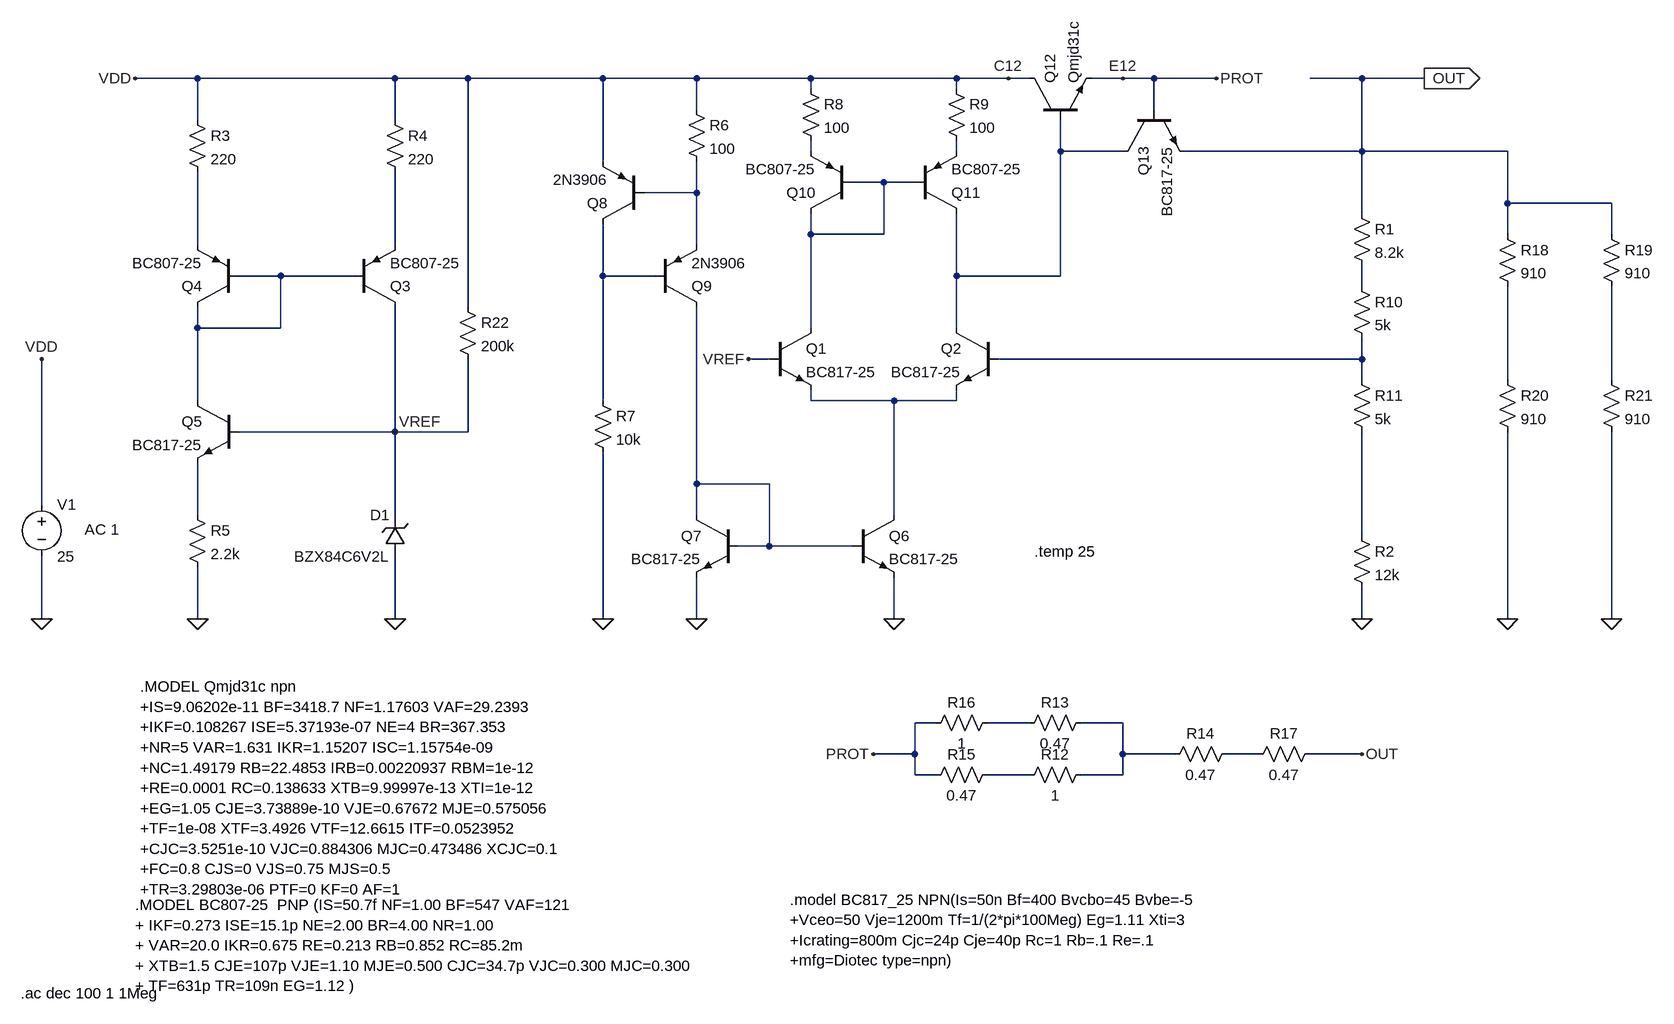
[diagram p0: schematic RRR.asc]
RRR.asc, the LTspice schematic file:
Version 4
SHEET 1 1204 680
WIRE -1040 -816 -1136 -816
WIRE -736 -816 -1040 -816
WIRE -624 -816 -736 -816
WIRE -416 -816 -624 -816
WIRE -272 -816 -416 -816
WIRE -96 -816 -272 -816
WIRE 128 -816 -96 -816
WIRE 208 -816 128 -816
WIRE 240 -816 208 -816
WIRE 384 -816 336 -816
WIRE 432 -816 384 -816
WIRE 528 -816 432 -816
WIRE 752 -816 672 -816
WIRE 848 -816 752 -816
WIRE -96 -800 -96 -816
WIRE 128 -800 128 -816
WIRE -272 -768 -272 -816
WIRE 432 -768 432 -816
WIRE -1040 -752 -1040 -816
WIRE -736 -752 -736 -816
WIRE -96 -704 -96 -720
WIRE 128 -704 128 -720
WIRE 288 -704 288 -752
WIRE 384 -704 288 -704
WIRE 752 -704 752 -816
WIRE 752 -704 480 -704
WIRE 976 -704 752 -704
WIRE -416 -688 -416 -816
WIRE 16 -656 -32 -656
WIRE 64 -656 16 -656
WIRE -272 -640 -272 -688
WIRE -272 -640 -352 -640
WIRE 976 -624 976 -704
WIRE 1136 -624 976 -624
WIRE 752 -608 752 -704
WIRE -96 -576 -96 -608
WIRE 16 -576 16 -656
WIRE 16 -576 -96 -576
WIRE 976 -576 976 -624
WIRE 1136 -576 1136 -624
WIRE -1040 -560 -1040 -672
WIRE -736 -560 -736 -672
WIRE -272 -560 -272 -640
WIRE -912 -512 -976 -512
WIRE -800 -512 -912 -512
WIRE -416 -512 -416 -592
WIRE -336 -512 -416 -512
WIRE 128 -512 128 -608
WIRE 288 -512 288 -704
WIRE 288 -512 128 -512
WIRE 752 -496 752 -528
WIRE -624 -464 -624 -816
WIRE -1040 -432 -1040 -464
WIRE -912 -432 -912 -512
WIRE -912 -432 -1040 -432
WIRE -96 -432 -96 -576
WIRE 128 -432 128 -512
WIRE -160 -384 -192 -384
WIRE 752 -384 752 -416
WIRE 752 -384 192 -384
WIRE 752 -352 752 -384
WIRE 976 -352 976 -496
WIRE 1136 -352 1136 -496
WIRE -1040 -320 -1040 -432
WIRE -416 -320 -416 -512
WIRE -96 -320 -96 -336
WIRE 32 -320 -96 -320
WIRE 128 -320 128 -336
WIRE 128 -320 32 -320
WIRE -736 -272 -736 -464
WIRE -736 -272 -976 -272
WIRE -624 -272 -624 -384
WIRE -624 -272 -736 -272
WIRE -272 -192 -272 -464
WIRE -160 -192 -272 -192
WIRE -1280 -160 -1280 -384
WIRE -1040 -144 -1040 -224
WIRE -736 -144 -736 -272
WIRE -272 -144 -272 -192
WIRE 32 -144 32 -320
WIRE 752 -112 752 -272
WIRE -160 -96 -160 -192
WIRE -160 -96 -208 -96
WIRE -32 -96 -160 -96
WIRE -1280 16 -1280 -80
WIRE -1040 16 -1040 -64
WIRE -736 16 -736 -80
WIRE -416 16 -416 -240
WIRE -272 16 -272 -48
WIRE 32 16 32 -48
WIRE 752 16 752 -32
WIRE 976 16 976 -272
WIRE 1136 16 1136 -272
WIRE 96 176 64 176
WIRE 240 176 176 176
WIRE 384 176 320 176
WIRE 64 224 64 176
WIRE 64 224 0 224
WIRE 384 224 384 176
WIRE 464 224 384 224
WIRE 592 224 544 224
WIRE 752 224 672 224
WIRE 64 256 64 224
WIRE 96 256 64 256
WIRE 240 256 176 256
WIRE 384 256 384 224
WIRE 384 256 320 256
FLAG 752 16 0
FLAG -1040 16 0
FLAG 32 16 0
FLAG -272 16 0
FLAG -416 16 0
FLAG -192 -384 VREF
FLAG 848 -816 OUT
IOPIN 848 -816 Out
FLAG 208 -816 C12
FLAG 384 -816 E12
FLAG -1280 16 0
FLAG 528 -816 PROT
FLAG 0 224 PROT
FLAG 752 224 OUT
FLAG -1280 -384 VDD
FLAG -1136 -816 VDD
FLAG -736 16 0
FLAG -736 -272 VREF
FLAG 976 16 0
FLAG 1136 16 0
SYMBOL npn -160 -432 R0
SYMATTR InstName Q1
SYMATTR Value BC817-25
SYMBOL npn 192 -432 M0
SYMATTR InstName Q2
SYMATTR Value BC817-25
SYMBOL res 736 -624 R0
SYMATTR InstName R1
SYMATTR Value 8.2k
SYMBOL res 736 -128 R0
SYMATTR InstName R2
SYMATTR Value 12k
SYMBOL pnp -800 -464 M180
SYMATTR InstName Q3
SYMATTR Value BC807-25
SYMBOL pnp -976 -464 R180
SYMATTR InstName Q4
SYMATTR Value BC807-25
SYMBOL npn -976 -320 M0
SYMATTR InstName Q5
SYMATTR Value BC817-25
SYMBOL res -1056 -768 R0
SYMATTR InstName R3
SYMATTR Value 220
SYMBOL res -752 -768 R0
SYMATTR InstName R4
SYMATTR Value 220
SYMBOL res -1056 -160 R0
SYMATTR InstName R5
SYMATTR Value 2.2k
SYMBOL npn -32 -144 R0
SYMATTR InstName Q6
SYMATTR Value BC817-25
SYMBOL npn -208 -144 M0
SYMATTR InstName Q7
SYMATTR Value BC817-25
SYMBOL pnp -352 -592 R180
SYMATTR InstName Q8
SYMATTR Value 2N3906
SYMBOL pnp -336 -464 M180
SYMATTR InstName Q9
SYMATTR Value 2N3906
SYMBOL res -288 -784 R0
SYMATTR InstName R6
SYMATTR Value 100
SYMBOL res -432 -336 R0
SYMATTR InstName R7
SYMATTR Value 10k
SYMBOL pnp -32 -608 R180
SYMATTR InstName Q10
SYMATTR Value BC807-25
SYMBOL pnp 64 -608 M180
SYMATTR InstName Q11
SYMATTR Value BC807-25
SYMBOL npn 240 -752 R270
SYMATTR InstName Q12
SYMATTR Value Qmjd31c
SYMBOL res -112 -816 R0
SYMATTR InstName R8
SYMATTR Value 100
SYMBOL res 112 -816 R0
SYMATTR InstName R9
SYMATTR Value 100
SYMBOL npn 384 -768 M90
SYMATTR InstName Q13
SYMATTR Value BC817-25
SYMBOL res 736 -512 R0
SYMATTR InstName R10
SYMATTR Value 5k
SYMBOL res 736 -368 R0
SYMATTR InstName R11
SYMATTR Value 5k
SYMBOL res 336 240 R90
WINDOW 0 0 56 VBottom 2
WINDOW 3 32 56 VTop 2
SYMATTR InstName R12
SYMATTR Value 1
SYMBOL res 336 160 R90
WINDOW 0 0 56 VBottom 2
WINDOW 3 32 56 VTop 2
SYMATTR InstName R13
SYMATTR Value 0.47
SYMBOL res 560 208 R90
WINDOW 0 0 56 VBottom 2
WINDOW 3 32 56 VTop 2
SYMATTR InstName R14
SYMATTR Value 0.47
SYMBOL res 192 240 R90
WINDOW 0 0 56 VBottom 2
WINDOW 3 32 56 VTop 2
SYMATTR InstName R15
SYMATTR Value 0.47
SYMBOL res 192 160 R90
WINDOW 0 0 56 VBottom 2
WINDOW 3 32 56 VTop 2
SYMATTR InstName R16
SYMATTR Value 1
SYMBOL res 688 208 R90
WINDOW 0 0 56 VBottom 2
WINDOW 3 32 56 VTop 2
SYMATTR InstName R17
SYMATTR Value 0.47
SYMBOL zener -720 -80 R180
WINDOW 0 24 64 Left 2
WINDOW 3 24 0 Left 2
SYMATTR InstName D1
SYMATTR Value BZX84C6V2L
SYMBOL voltage -1280 -176 R0
WINDOW 123 66 54 Left 2
WINDOW 39 0 0 Left 0
SYMATTR Value2 AC 1
SYMATTR InstName V1
SYMATTR Value 25
SYMBOL res 960 -592 R0
SYMATTR InstName R18
SYMATTR Value 910
SYMBOL res 1120 -592 R0
SYMATTR InstName R19
SYMATTR Value 910
SYMBOL res 960 -368 R0
SYMATTR InstName R20
SYMATTR Value 910
SYMBOL res 1120 -368 R0
SYMATTR InstName R21
SYMATTR Value 910
SYMBOL res -640 -480 R0
SYMATTR InstName R22
SYMATTR Value 200k
TEXT -128 448 Left 2 !.model BC817_25 NPN(Is=50n Bf=400 Bvcbo=45 Bvbe=-5\n+Vceo=50 Vje=1200m Tf=1/(2*pi*100Meg) Eg=1.11 Xti=3\n+Icrating=800m Cjc=24p Cje=40p Rc=1 Rb=.1 Re=.1\n+mfg=Diotec type=npn)
TEXT -1128 120 Left 2 !.MODEL Qmjd31c npn\n+IS=9.06202e-11 BF=3418.7 NF=1.17603 VAF=29.2393\n+IKF=0.108267 ISE=5.37193e-07 NE=4 BR=367.353\n+NR=5 VAR=1.631 IKR=1.15207 ISC=1.15754e-09\n+NC=1.49179 RB=22.4853 IRB=0.00220937 RBM=1e-12\n+RE=0.0001 RC=0.138633 XTB=9.99997e-13 XTI=1e-12\n+EG=1.05 CJE=3.73889e-10 VJE=0.67672 MJE=0.575056\n+TF=1e-08 XTF=3.4926 VTF=12.6615 ITF=0.0523952\n+CJC=3.5251e-10 VJC=0.884306 MJC=0.473486 XCJC=0.1\n+FC=0.8 CJS=0 VJS=0.75 MJS=0.5\n+TR=3.29803e-06 PTF=0 KF=0 AF=1
TEXT -1136 456 Left 2 !.MODEL BC807-25  PNP (IS=50.7f NF=1.00 BF=547 VAF=121\n+ IKF=0.273 ISE=15.1p NE=2.00 BR=4.00 NR=1.00\n+ VAR=20.0 IKR=0.675 RE=0.213 RB=0.852 RC=85.2m\n+ XTB=1.5 CJE=107p VJE=1.10 MJE=0.500 CJC=34.7p VJC=0.300 MJC=0.300 \n+ TF=631p TR=109n EG=1.12 )
TEXT 248 -88 Left 2 !.temp 25
TEXT -1312 592 Left 2 !.ac dec 100 1 1Meg

The netlist it stands for:
* RRR.asc
Q1 N004 VREF N014 0 BC817-25
Q2 N003 N011 N014 0 BC817-25
R1 OUT N010 8.2k
R2 N017 0 12k
Q3 VREF N008 N007 0 BC807-25
Q4 N008 N008 N006 0 BC807-25
Q5 N008 VREF N016 0 BC817-25
R3 VDD N006 220
R4 VDD N007 220
R5 N016 0 2.2k
Q6 N014 N015 0 0 BC817-25
Q7 N015 N015 0 0 BC817-25
Q8 N009 N005 VDD 0 2N3906
Q9 N015 N009 N005 0 2N3906
R6 VDD N005 100
R7 N009 0 10k
Q10 N004 N004 N001 0 BC807-25
Q11 N003 N004 N002 0 BC807-25
Q12 VDD N003 PROT 0 Qmjd31c
R8 VDD N001 100
R9 VDD N002 100
Q13 N003 PROT OUT 0 BC817-25
R10 N010 N011 5k
R11 N011 N017 5k
R12 N019 N021 1
R13 N019 N018 0.47
R14 N020 N019 0.47
R15 N021 PROT 0.47
R16 N018 PROT 1
R17 OUT N020 0.47
D1 0 VREF BZX84C6V2L
V1 VDD 0 25 AC 1
R18 OUT N012 910
R19 OUT N013 910
R20 N012 0 910
R21 N013 0 910
R22 VDD VREF 200k
.model D D
.lib standard.dio
.model NPN NPN
.model PNP PNP
.lib standard.bjt
.model BC817_25 NPN(Is=50n Bf=400 Bvcbo=45 Bvbe=-5
+Vceo=50 Vje=1200m Tf=1/(2*pi*100Meg) Eg=1.11 Xti=3
+Icrating=800m Cjc=24p Cje=40p Rc=1 Rb=.1 Re=.1
+mfg=Diotec type=npn)
.MODEL Qmjd31c npn
+IS=9.06202e-11 BF=3418.7 NF=1.17603 VAF=29.2393
+IKF=0.108267 ISE=5.37193e-07 NE=4 BR=367.353
+NR=5 VAR=1.631 IKR=1.15207 ISC=1.15754e-09
+NC=1.49179 RB=22.4853 IRB=0.00220937 RBM=1e-12
+RE=0.0001 RC=0.138633 XTB=9.99997e-13 XTI=1e-12
+EG=1.05 CJE=3.73889e-10 VJE=0.67672 MJE=0.575056
+TF=1e-08 XTF=3.4926 VTF=12.6615 ITF=0.0523952
+CJC=3.5251e-10 VJC=0.884306 MJC=0.473486 XCJC=0.1
+FC=0.8 CJS=0 VJS=0.75 MJS=0.5
+TR=3.29803e-06 PTF=0 KF=0 AF=1
.MODEL BC807-25  PNP (IS=50.7f NF=1.00 BF=547 VAF=121
+ IKF=0.273 ISE=15.1p NE=2.00 BR=4.00 NR=1.00
+ VAR=20.0 IKR=0.675 RE=0.213 RB=0.852 RC=85.2m
+ XTB=1.5 CJE=107p VJE=1.10 MJE=0.500 CJC=34.7p VJC=0.300 MJC=0.300
+ TF=631p TR=109n EG=1.12 )
.temp 25
.ac dec 100 1 1Meg
.backanno
.end